# Altium schematic sheet DRV_schem_1.SchDoc
size A
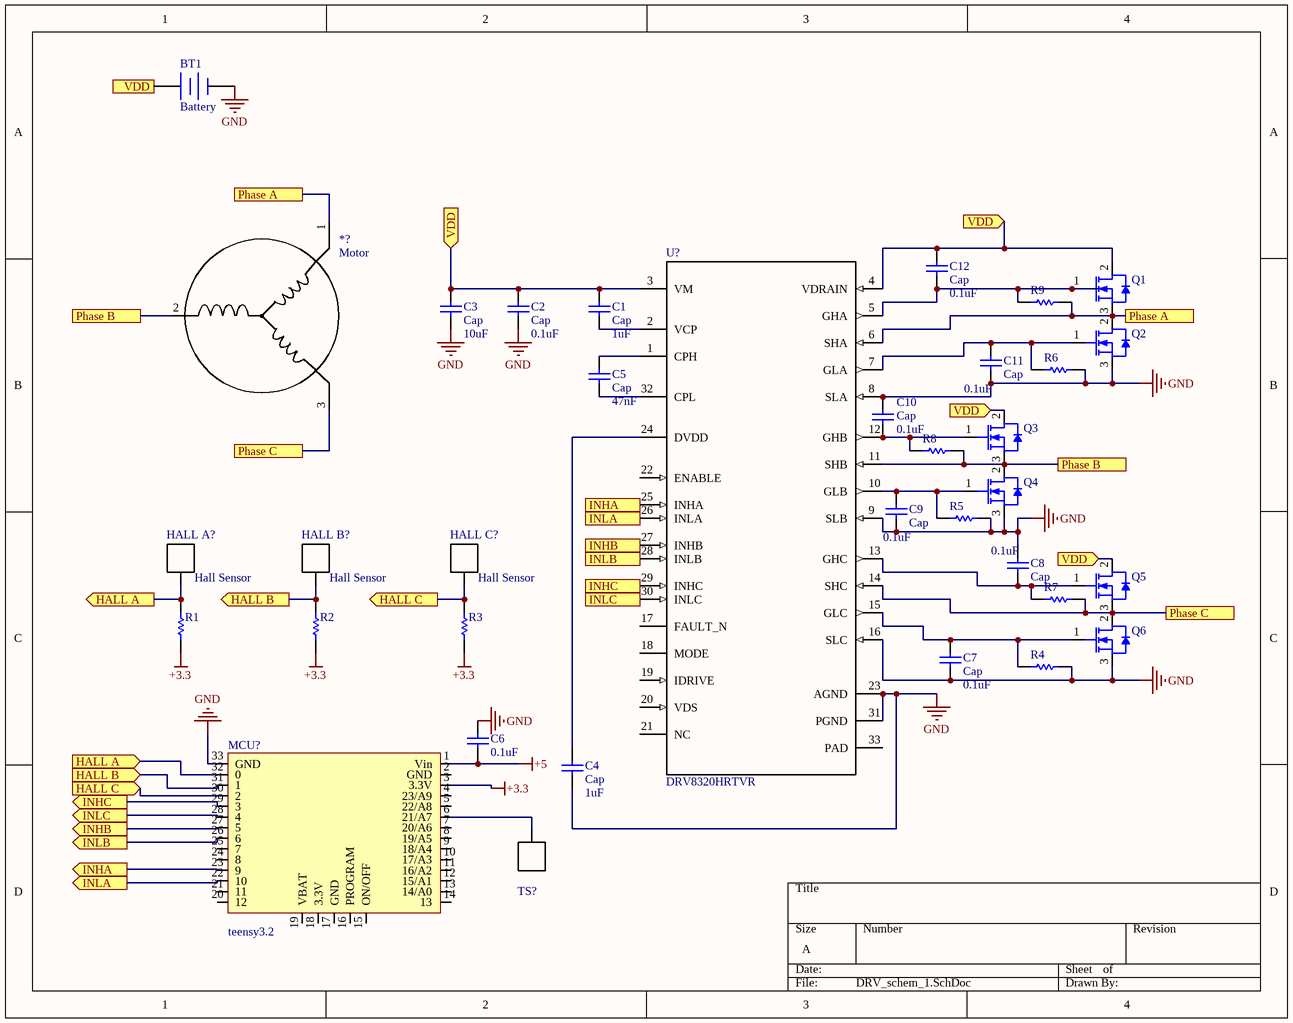
[diagram p0: DRV_schem_1.SchDoc]

## Parts
*?  Motor  [Motor]
BT1  Battery  [BAT-2]
C1  Cap  value 1uF  [RAD-0.3]
C2  Cap  value 0.1uF  [RAD-0.3]
C3  Cap  value 10uF  [RAD-0.3]
C4  Cap  value 1uF  [RAD-0.3]
C5  Cap  value 47nF  [RAD-0.3]
C6  0.1uF  [CAPC2013X140X45NL15T25]
C7  Cap  value 0.1uF  [RAD-0.3]
C8  Cap  value 0.1uF  [RAD-0.3]
C9  Cap  value 0.1uF  [RAD-0.3]
C10  Cap  value 0.1uF  [RAD-0.3]
C11  Cap  value 0.1uF  [RAD-0.3]
C12  Cap  value 0.1uF  [RAD-0.3]
HALL_A?  Hall Sensor  [A single pin]
HALL_B?  Hall Sensor  [A single pin]
HALL_C?  Hall Sensor  [A single pin]
MCU?  teensy3.2  [teensy3.2]
Q1  INFINEON  [MOSFET-2]  (value not drawn)
Q2  INFINEON  [MOSFET-2]  (value not drawn)
Q3  INFINEON  [MOSFET-2]  (value not drawn)
Q4  INFINEON  [MOSFET-2]  (value not drawn)
Q5  INFINEON  [MOSFET-2]  (value not drawn)
Q6  INFINEON  [MOSFET-2]  (value not drawn)
R1  CRCW08050000Z0EA  [RESC2013X50X30LL20T20]  (value not drawn)
R2  CRCW08050000Z0EA  [RESC2013X50X30LL20T20]  (value not drawn)
R3  CRCW08050000Z0EA  [RESC2013X50X30LL20T20]  (value not drawn)
R4  CRCW08050000Z0EA  [RESC2013X50X30LL20T20]  (value not drawn)
R5  CRCW08050000Z0EA  [RESC2013X50X30LL20T20]  (value not drawn)
R6  CRCW08050000Z0EA  [RESC2013X50X30LL20T20]  (value not drawn)
R7  CRCW08050000Z0EA  [RESC2013X50X30LL20T20]  (value not drawn)
R8  CRCW08050000Z0EA  [RESC2013X50X30LL20T20]  (value not drawn)
R9  CRCW08050000Z0EA  [RESC2013X50X30LL20T20]  (value not drawn)
TS?  (no value)  [A single pin]
U?  DRV8320HRTVR  [RTV0032E]

## Ports
HALL A (in), HALL A (out), HALL B (in), HALL B (out), HALL C (in), HALL C (out), INHA (in), INHA (out), INHB (in), INHB (out), INHC (in), INHC (out), INLA (in), INLA (out), INLB (in), INLB (out), INLC (in), INLC (out), Phase A, Phase B, Phase C, VDD (in), VDD (out)

## Nets
+3.3: MCU?.3(3.3V) R1.1 R2.1 R3.1
+5: C6.1 MCU?.1(Vin)
GND: BT1.2(-) C2.1 C3.1 C4.1 C6.2 C7.1 C8.2 C9.1 C10.2 C11.1 MCU?.33(GND) Q2.3(S) Q4.3(S) Q6.3(S) R4.1 R5.1 R6.1 U?.8(SLA) U?.9(SLB) U?.16(SLC) U?.23(AGND) U?.31(PGND)
HALL A: HALL_A?.0 MCU?.32(0) R1.2 ; port HALL A
HALL B: HALL_B?.0 MCU?.31(1) R2.2 ; port HALL B
HALL C: HALL_C?.0 MCU?.30(2) R3.2 ; port HALL C
INHA: MCU?.23(9) U?.25(INHA) ; port INHA
INHB: MCU?.27(5) U?.27(INHB) ; port INHB
INHC: MCU?.29(3) U?.29(INHC) ; port INHC
INLA: MCU?.22(10) U?.26(INLA) ; port INLA
INLB: MCU?.26(6) U?.28(INLB) ; port INLB
INLC: MCU?.28(4) U?.30(INLC) ; port INLC
Phase A: *?.1(A) Q1.3(S) Q2.2(D) R9.1 U?.6(SHA) ; port Phase A
Phase B: *?.2(B) Q3.3(S) Q4.2(D) R8.1 U?.11(SHB) ; port Phase B
Phase C: *?.3(C) Q5.3(S) Q6.2(D) R7.1 U?.14(SHC) ; port Phase C
VDD: BT1.1(+) C1.2 C2.2 C3.2 C12.2 Q1.2(D) Q3.2(D) Q5.2(D) U?.3(VM) U?.4(VDRAIN) ; port VDD
NetC1_1: C1.1 U?.2(VCP)
NetC4_2: C4.2 U?.24(DVDD)
NetC5_1: C5.1 U?.32(CPL)
NetC5_2: C5.2 U?.1(CPH)
NetC7_2: C7.2 Q6.1(G) R4.2 U?.15(GLC)
NetC8_1: C8.1 Q5.1(G) R7.2 U?.13(GHC)
NetC9_2: C9.2 Q4.1(G) R5.2 U?.10(GLB)
NetC10_1: C10.1 Q3.1(G) R8.2 U?.12(GHB)
NetC11_2: C11.2 Q2.1(G) R6.2 U?.7(GLA)
NetC12_1: C12.1 Q1.1(G) R9.2 U?.5(GHA)
NetMCU?_6: MCU?.6(21/A7) TS?.0

Not connected (* = marked no-connect by the designer): MCU? 2(GND) 4(23/A9) 5(22/A8) 7(20/A6) 8(19/A5) 9(18/A4) 10(17/A3) 11(16/A2) 12(15/A1) 13(14/A0) 14(13) 15(ON/OFF) 16(PROGRAM) 17(GND) 18(3.3V) 19(VBAT) 20(12) 21(11) 24(8) 25(7); U? 17(FAULT_N) 18(MODE) 19(IDRIVE) 20(VDS) 21(NC) 22(ENABLE) 33(PAD)

## Library data of the parts
BT1 = Battery: Multicell Battery; Published: 24-Mar-1999; LatestRevisionDate: 17-Jul-2002; LatestRevisionNote: Re-released for DXP Platform.; PackageReference: BAT-2; Publisher: Altium Limited; PackageDescription: Battery; 2 Leads
C1-C5 C7-C12 = Cap: Capacitor; Published: 8-Jun-2000; LatestRevisionDate: 17-Jul-2002; LatestRevisionNote: Re-released for DXP Platform.; PackageReference: RAD-0.3; Publisher: Altium Limited; PackageDescription: Radial Cap, Thru-Hole; 2 Leads; 0.3 in Pin Spacing
C6 = CMP-2007-03385-1: Manufacturer: Murata; Part Number: GRM21BR60J226ME39L
R1-R9 = CMP-2001-04896-1: Manufacturer: Vishay Dale; Part Number: CRCW08050000Z0EA
TS? = Hall Sensor
U? = DRV8320HRTVR: No Description Available; Manufacturer: Texas Instruments; PartNumber: DRV8320HRTVR; RefDes: RefDes; Type: DEV; Value: Value; Copyright: Copyright (C) 2018 Accelerated Designs. All rights reserved